# Altium schematic sheet main.SchDoc
size A3
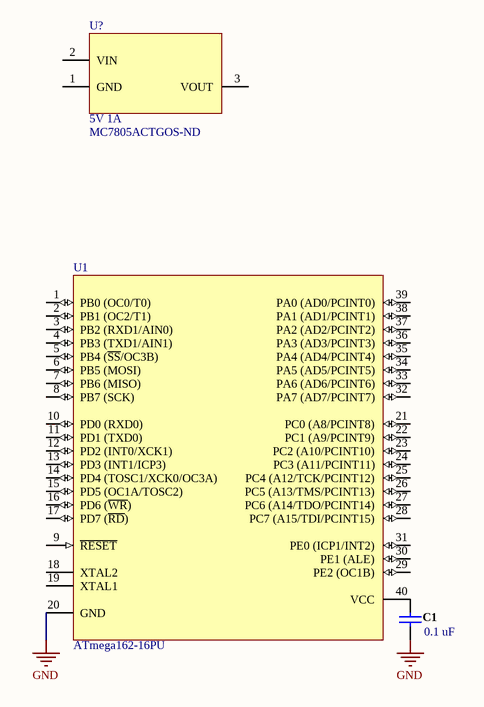
[diagram p0: main.SchDoc]

## Parts
C1  Capacitance: 0.1 uF  [CAPC1005]  (hidden comment: CC0402KRX7R7BB104)
U1  ATmega162-16PU  [40P6]
U?  5V 1A  Supplier Part Number 1: MC7805ACTGOS-ND  [MC7805ACTG]

## Nets
GND: C1.2 U1.20(GND)
NetC1_1: C1.1 U1.40(VCC)

Not connected (* = marked no-connect by the designer): U1 1(PB0_(OC0/T0)) 2(PB1_(OC2/T1)) 3(PB2_(RXD1/AIN0)) 4(PB3_(TXD1/AIN1)) 5(PB4_(~{SS}/OC3B)) 6(PB5_(MOSI)) 7(PB6_(MISO)) 8(PB7_(SCK)) 9(~{RESET}) 10(PD0_(RXD0)) 11(PD1_(TXD0)) 12(PD2_(INT0/XCK1)) 13(PD3_(INT1/ICP3)) 14(PD4_(TOSC1/XCK0/OC3A)) 15(PD5_(OC1A/TOSC2)) 16(PD6_(~{WR})) 17(PD7_(~{RD})) 18(XTAL2) 19(XTAL1) 21(PC0_(A8/PCINT8)) 22(PC1_(A9/PCINT9)) 23(PC2_(A10/PCINT10)) 24(PC3_(A11/PCINT11)) 25(PC4_(A12/TCK/PCINT12)) 26(PC5_(A13/TMS/PCINT13)) 27(PC6_(A14/TDO/PCINT14)) 28(PC7_(A15/TDI/PCINT15)) 29(PE2_(OC1B)) 30(PE1_(ALE)) 31(PE0_(ICP1/INT2)) 32(PA7_(AD7/PCINT7)) 33(PA6_(AD6/PCINT6)) 34(PA5_(AD5/PCINT5)) 35(PA4_(AD4/PCINT4)) 36(PA3_(AD3/PCINT3)) 37(PA2_(AD2/PCINT2)) 38(PA1_(AD1/PCINT1)) 39(PA0_(AD0/PCINT0)); U? 1(GND) 2(VIN) 3(VOUT)

## Library data of the parts
C1 = CMP-0001-00074-1: Capacitor, Yageo, Ceramic, 0.1uF 10% 16V 0402 (1005) X7R; Polarity: Non-Polarized; ClassName: Board Template Device; Rated Voltage: 16 V; Status: Production; Tolerance: 10 %; Mounting Technology: Surface Mount; Technology: Ceramic; Category: Capacitor; Dielectric: X7R; Publisher: Altium
U1 = CMP-0095-00017-3: 8-bit AVR Microcontroller, 16KB Flash, 512 Bytes EEPROM, 1KB SRAM, 40-pin PDIP, Industrial Grade (-40°C to 85°C); RevisionNote: Schematic symbol link corrected; ComponentLink3URL: http://www.atmel.com/dyn/resources/prod_documents/2513S.pdf; ComponentLink3Description: ATmega162 (V) Summary; PartNumber: ATmega162-16PU; ComponentLink2URL: http://www.atmel.com/dyn/resources/prod_documents/doc2513.pdf; ComponentLink1URL: http://www.atmel.com/; DatasheetVersion: revK, Jul-2009; ComponentLink1Description: Manufacturer URL; PackageDescription: 40-lead (0.600"/15.24mm Wide) Plastic Dual Inline Package (PDIP); PackageVersion: revB, Sep-2001; Code_JEDEC: MS-011-AC; ComponentLink2Description: ATmega162 (V)  Datasheet; PackageReference: 40P6
U? = MC7805ACTG: IC REG LDO 5V 1A TO220AB; Manufacturer: ON Semiconductor; Regulator Topology: Positive Fixed; Voltage - Dropout (Typical): 2V @ 1A; Number of Regulators: 1; Voltage - Input: Up to 35V; Supplier 1: Digi-Key; Manufacturer Part Number: MC7805ACTG; RoHS: RoHS Compliant; Category: Integrated Circuits (ICs); Stock 1: 4889; Pricing 1: 1=0.48, 10=0.408, 100=0.3044, 500=0.23924, 1000=0.18487 (EUR); Packaging: Tube; Part Status: Active; Current - Output: 1A; Current - Limit (Min): -; Operating Temperature: 0°C ~ 125°C; Mounting Type: Through Hole; Package / Case: TO-220-3; Supplier Device Package: TO-220AB; ComponentLink1URL: http://www.onsemi.com/pub_link/Collateral/MC7800-D.PDF; ComponentLink1Description: http://www.onsemi.com/pub_link/Collateral/MC7800-D.PDF; Voltage - Output: 5V